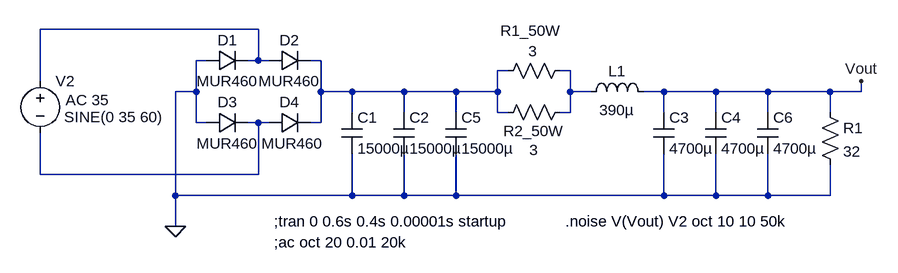
[diagram p0: schematic PS_noise.asc]
PS_noise.asc, the LTspice schematic file:
Version 4
SHEET 1 1416 680
WIRE -96 80 -432 80
WIRE -176 128 -192 128
WIRE -96 128 -96 80
WIRE -96 128 -112 128
WIRE -80 128 -96 128
WIRE 0 128 -16 128
WIRE 288 144 272 144
WIRE 384 144 368 144
WIRE -432 160 -432 80
WIRE -192 176 -192 128
WIRE -192 176 -224 176
WIRE 0 176 0 128
WIRE 48 176 0 176
WIRE 128 176 48 176
WIRE 208 176 128 176
WIRE 272 176 272 144
WIRE 272 176 208 176
WIRE 384 176 384 144
WIRE 416 176 384 176
WIRE 528 176 496 176
WIRE 608 176 528 176
WIRE 688 176 608 176
WIRE 784 176 688 176
WIRE 832 176 832 160
WIRE 832 176 784 176
WIRE 48 208 48 176
WIRE 128 208 128 176
WIRE 208 208 208 176
WIRE 272 208 272 176
WIRE 288 208 272 208
WIRE 384 208 384 176
WIRE 384 208 368 208
WIRE 528 208 528 176
WIRE 608 208 608 176
WIRE 688 208 688 176
WIRE 784 208 784 176
WIRE -192 224 -192 176
WIRE -176 224 -192 224
WIRE -96 224 -112 224
WIRE -80 224 -96 224
WIRE 0 224 0 176
WIRE 0 224 -16 224
WIRE -432 304 -432 240
WIRE -96 304 -96 224
WIRE -96 304 -432 304
WIRE -224 336 -224 176
WIRE 48 336 48 272
WIRE 48 336 -224 336
WIRE 128 336 128 272
WIRE 128 336 48 336
WIRE 208 336 208 272
WIRE 208 336 128 336
WIRE 528 336 528 272
WIRE 528 336 208 336
WIRE 608 336 608 272
WIRE 608 336 528 336
WIRE 688 336 688 272
WIRE 688 336 608 336
WIRE 784 336 784 288
WIRE 784 336 688 336
WIRE -224 384 -224 336
FLAG -224 384 0
FLAG 832 160 Vout
SYMBOL voltage -432 144 R0
WINDOW 3 37 71 Left 2
WINDOW 123 39 45 Left 2
WINDOW 39 0 0 Left 2
SYMATTR Value SINE(0 35 60)
SYMATTR Value2 AC 35
SYMATTR InstName V2
SYMBOL diode -176 144 R270
WINDOW 3 0 32 VBottom 2
WINDOW 0 32 32 VTop 2
SYMATTR Value MUR460
SYMATTR InstName D1
SYMBOL diode -80 144 R270
WINDOW 0 32 32 VTop 2
WINDOW 3 0 32 VBottom 2
SYMATTR InstName D2
SYMATTR Value MUR460
SYMBOL ind 400 192 R270
WINDOW 0 32 56 VTop 2
WINDOW 3 3 56 VBottom 2
SYMATTR InstName L1
SYMATTR Value 390µ
SYMATTR SpiceLine Rser=72m
SYMBOL cap 512 208 R0
SYMATTR InstName C3
SYMATTR Value 4700µ
SYMATTR SpiceLine Rser=71m
SYMBOL diode -176 240 R270
WINDOW 0 32 32 VTop 2
WINDOW 3 0 32 VBottom 2
SYMATTR InstName D3
SYMATTR Value MUR460
SYMBOL diode -80 240 R270
WINDOW 0 32 32 VTop 2
WINDOW 3 0 36 VBottom 2
SYMATTR InstName D4
SYMATTR Value MUR460
SYMBOL cap 592 208 R0
SYMATTR InstName C4
SYMATTR Value 4700µ
SYMATTR SpiceLine Rser=71m
SYMBOL res 384 128 R90
WINDOW 0 -30 61 VBottom 2
WINDOW 3 -30 58 VTop 2
SYMATTR InstName R1_50W
SYMATTR Value 3
SYMBOL cap 112 208 R0
SYMATTR InstName C2
SYMATTR Value 15000µ
SYMATTR SpiceLine Rser=31m
SYMBOL res 384 192 R90
WINDOW 0 60 56 VBottom 2
WINDOW 3 58 56 VTop 2
SYMATTR InstName R2_50W
SYMATTR Value 3
SYMBOL cap 32 208 R0
SYMATTR InstName C1
SYMATTR Value 15000µ
SYMATTR SpiceLine Rser=31m
SYMBOL cap 672 208 R0
SYMATTR InstName C6
SYMATTR Value 4700µ
SYMATTR SpiceLine Rser=71m
SYMBOL cap 192 208 R0
SYMATTR InstName C5
SYMATTR Value 15000µ
SYMATTR SpiceLine Rser=31m
SYMBOL res 768 192 R0
SYMATTR InstName R1
SYMATTR Value 32
TEXT -72 376 Left 2 !;tran 0 0.6s 0.4s 0.00001s startup
TEXT -72 408 Left 2 !;ac oct 20 0.01 20k
TEXT 376 376 Left 2 !.noise V(Vout) V2 oct 10 10 50k

The netlist it stands for:
* PS_noise.asc
V2 N001 N004 SINE(0 35 60) AC 35
D1 0 N001 MUR460
D2 N001 N002 MUR460
L1 N003 Vout 390µ Rser=72m
C3 Vout 0 4700µ Rser=71m
D3 0 N004 MUR460
D4 N004 N002 MUR460
C4 Vout 0 4700µ Rser=71m
R1_50W N003 N002 3
C2 N002 0 15000µ Rser=31m
R2_50W N003 N002 3
C1 N002 0 15000µ Rser=31m
C6 Vout 0 4700µ Rser=71m
C5 N002 0 15000µ Rser=31m
R1 Vout 0 32
.model D D
.lib standard.dio
;tran 0 0.6s 0.4s 0.00001s startup
;ac oct 20 0.01 20k
.noise V(Vout) V2 oct 10 10 50k
.backanno
.end